# EAGLE design a52-flashcart (EAGLE 7.0.0)
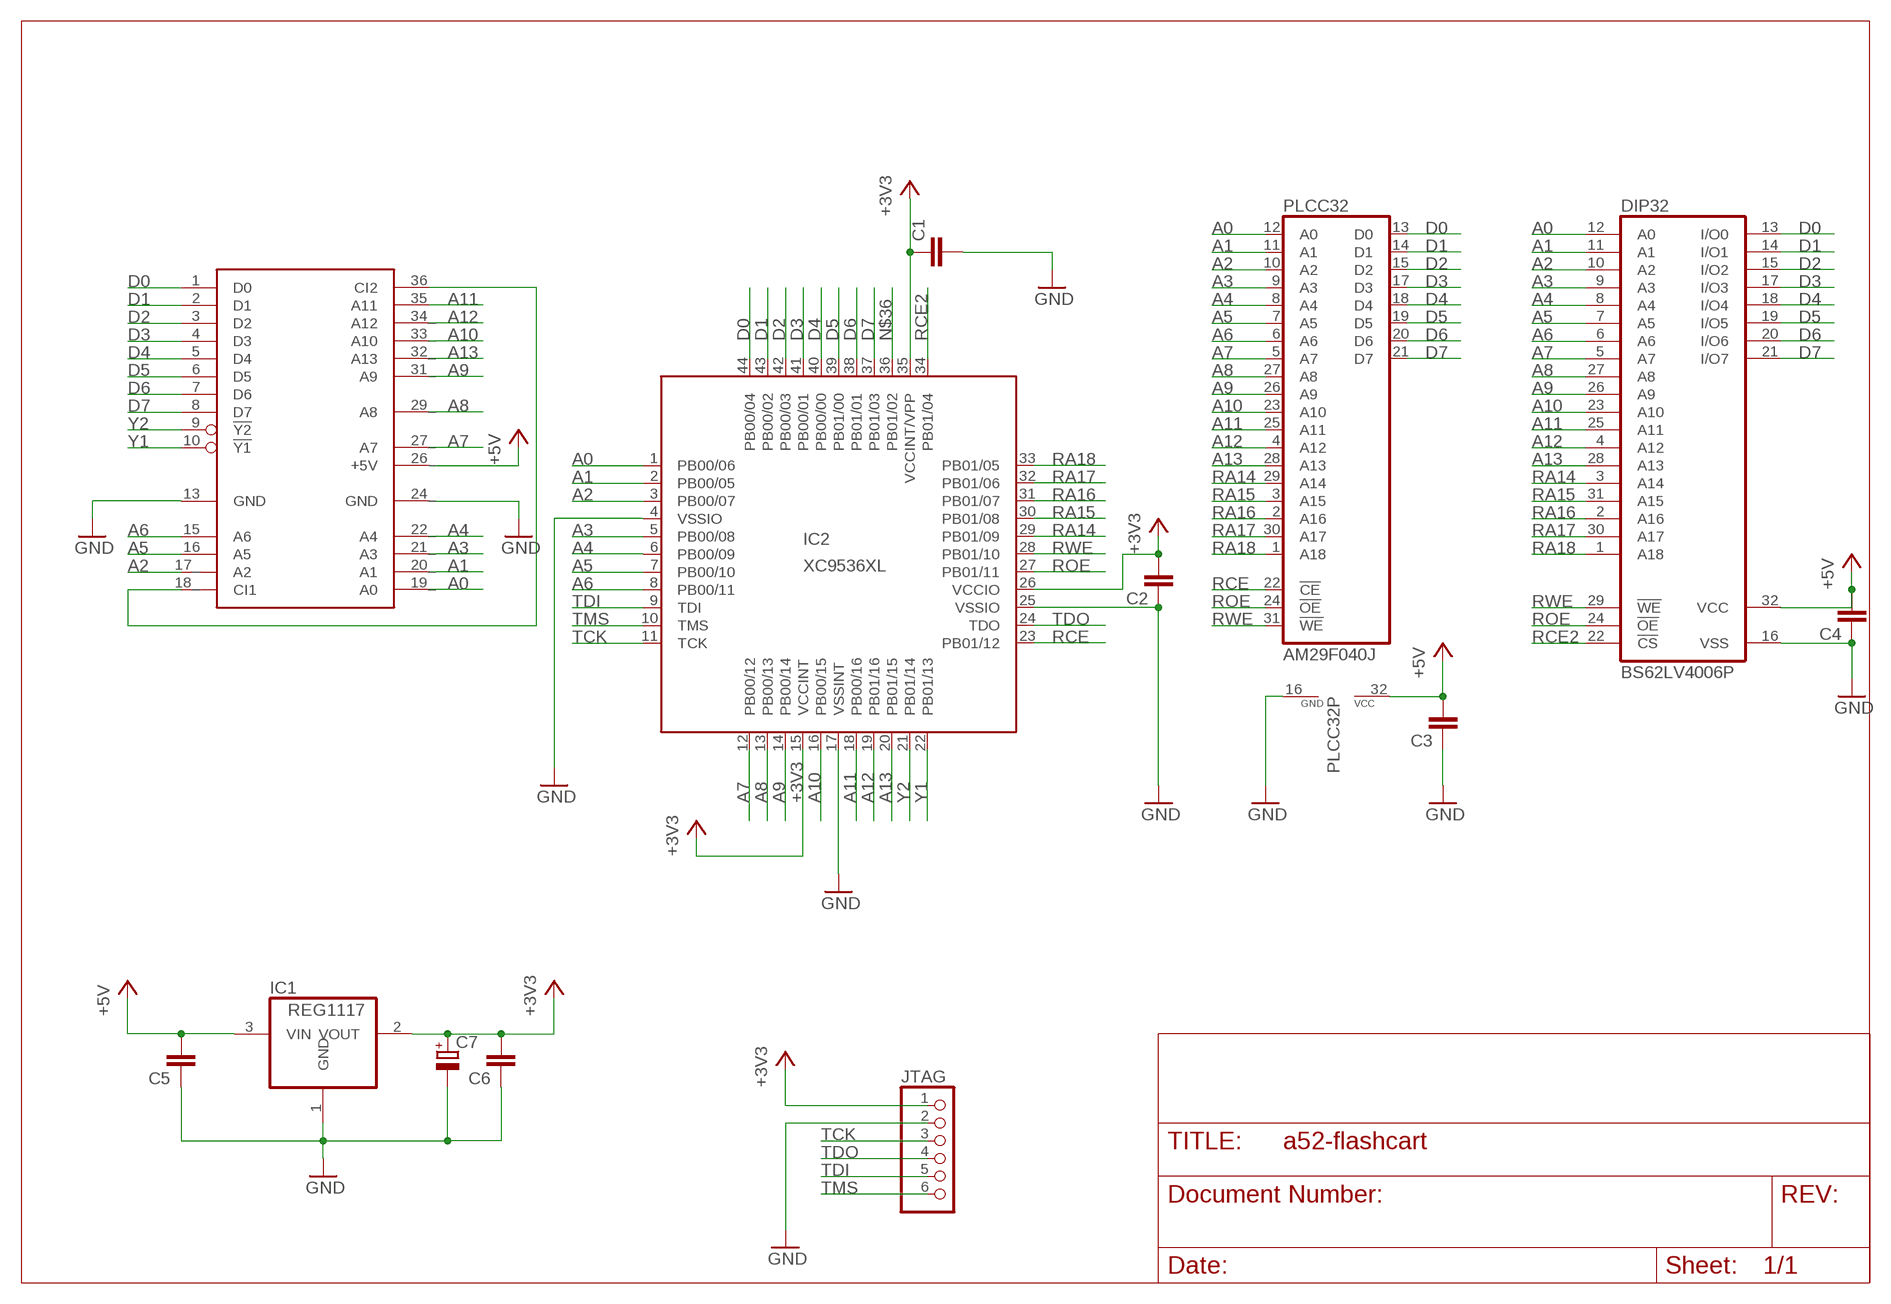
[diagram p0: schematic, sheet 1]

## Parts
C1  C-EUC0603  [C0603]
C2  C-EUC0603  [C0603]
C3  C-EUC0603  [C0603]
C4  C-EUC0603  [C0603]
C5  C-EUC0603  [C0603]
C6  C-EUC0603  [C0603]
C7  CPOL-EUE2,5-6E  [E25-6E]
DIP32  BS62LV4006P  [DIL-32]
IC1  REG1117  [SOT223]
IC2  XC9536XL  XC9536_44VQ  [SQFP-S-10X10-44]
JTAG  PINHD-1X6  [1X06]
PLCC32  AM29F040J  [PLCC32R]
U$1  ATARI-5200  [ATARI-5200]

## Nets
+3V3: C1.1 C2.2 C6.2 C7.+ IC1.2(VOUT) IC2.15(VCCINT) IC2.26(VCCIO) IC2.35(VCCINT/VPP) JTAG.1
+5V: C3.2 C4.2 C5.2 DIP32.32(VCC) IC1.3(VIN) PLCC32.32(VCC) U$1.26_(+5V)
A0: DIP32.12(A0) IC2.1(PB00/06) PLCC32.12(A0) U$1.19_(A0)
A1: DIP32.11(A1) IC2.2(PB00/05) PLCC32.11(A1) U$1.20_(A1)
A2: DIP32.10(A2) IC2.3(PB00/07) PLCC32.10(A2) U$1.17_(A2)
A3: DIP32.9(A3) IC2.5(PB00/08) PLCC32.9(A3) U$1.21_(A3)
A4: DIP32.8(A4) IC2.6(PB00/09) PLCC32.8(A4) U$1.22_(A4)
A5: DIP32.7(A5) IC2.7(PB00/10) PLCC32.7(A5) U$1.16(A5)
A6: DIP32.6(A6) IC2.8(PB00/11) PLCC32.6(A6) U$1.15(A6)
A7: DIP32.5(A7) IC2.12(PB00/12) PLCC32.5(A7) U$1.27_(A7)
A8: DIP32.27(A8) IC2.13(PB00/13) PLCC32.27(A8) U$1.29_(A8)
A9: DIP32.26(A9) IC2.14(PB00/14) PLCC32.26(A9) U$1.31_(A9)
A10: DIP32.23(A10) IC2.16(PB00/15) PLCC32.23(A10) U$1.33_(A10)
A11: DIP32.25(A11) IC2.18(PB00/16) PLCC32.25(A11) U$1.35(A11)
A12: DIP32.4(A12) IC2.19(PB01/16) PLCC32.4(A12) U$1.34_(A12)
A13: DIP32.28(A13) IC2.20(PB01/15) PLCC32.28(A13) U$1.32_(A13)
D0: DIP32.13(I/O0) IC2.44(PB00/04) PLCC32.13(D0) U$1.1(D0)
D1: DIP32.14(I/O1) IC2.43(PB00/02) PLCC32.14(D1) U$1.2(D1)
D2: DIP32.15(I/O2) IC2.42(PB00/03) PLCC32.15(D2) U$1.3(D2)
D3: DIP32.17(I/O3) IC2.41(PB00/01) PLCC32.17(D3) U$1.4(D3)
D4: DIP32.18(I/O4) IC2.40(PB00/00) PLCC32.18(D4) U$1.5(D4)
D5: DIP32.19(I/O5) IC2.39(PB01/00) PLCC32.19(D5) U$1.6(D5)
D6: DIP32.20(I/O6) IC2.38(PB01/01) PLCC32.20(D6) U$1.7(D6)
D7: DIP32.21(I/O7) IC2.37(PB01/03) PLCC32.21(D7) U$1.8(D7)
GND: C1.2 C2.1 C3.1 C4.1 C5.1 C6.1 C7.- DIP32.16(VSS) IC1.1(GND) IC2.4(VSSIO) IC2.17(VSSINT) IC2.25(VSSIO) JTAG.2 PLCC32.16(GND) U$1.13(GND) U$1.24_(GND)
N$14: U$1.18_(CI1) U$1.36(CI2)
N$36: IC2.36(PB01/02)
RA14: DIP32.3(A14) IC2.29(PB01/09) PLCC32.29(A14)
RA15: DIP32.31(A15) IC2.30(PB01/08) PLCC32.3(A15)
RA16: DIP32.2(A16) IC2.31(PB01/07) PLCC32.2(A16)
RA17: DIP32.30(A17) IC2.32(PB01/06) PLCC32.30(A17)
RA18: DIP32.1(A18) IC2.33(PB01/05) PLCC32.1(A18)
RCE: IC2.23(PB01/12) PLCC32.22(!CE)
RCE2: DIP32.22(!CS) IC2.34(PB01/04)
ROE: DIP32.24(!OE) IC2.27(PB01/11) PLCC32.24(!OE)
RWE: DIP32.29(!WE) IC2.28(PB01/10) PLCC32.31(!WE)
TCK: IC2.11(TCK) JTAG.3
TDI: IC2.9(TDI) JTAG.5
TDO: IC2.24(TDO) JTAG.4
TMS: IC2.10(TMS) JTAG.6
Y1: IC2.22(PB01/13) U$1.10(!Y1)
Y2: IC2.21(PB01/14) U$1.9(!Y2)

## Library data of the parts
C1-C6 = resistor:C-EU: CAPACITOR, European symbol
C7 = resistor:CPOL-EU: POLARIZED CAPACITOR, European symbol
DIP32 = memory-bsi:BS62LV4006
IC1 = burr-brown:REG1117: 800mA and 1A Low Dropout (LDO) Positive Regulator 1.8V, 2.5V, 2.85V, 3.3V, 5V, and Adj; MPN: REG1117; OC_FARNELL: 1097566; OC_NEWARK: 14P6981
IC2 = xilinx-xc9:XC9536_44VQ: xc9536_pc44 XC9500 In-System Programmable CPLD Family Auto generated by make-symbol-device-package-bsdl.ulp Rev. 34 Source: xc9536_vq44.bsd; MPN: XC9536-15VQG44C; OC_FARNELL: 1193227; OC_NEWARK: 98K3377
JTAG = adafruit:PINHD-1X6: PIN HEADER
PLCC32 = am29-memory:AM29F040J: 4-Megabit FLASH MEMORY (512 K x 8 bit) 5 V-only
U$1 = a52-cartridge:ATARI-5200

## Board
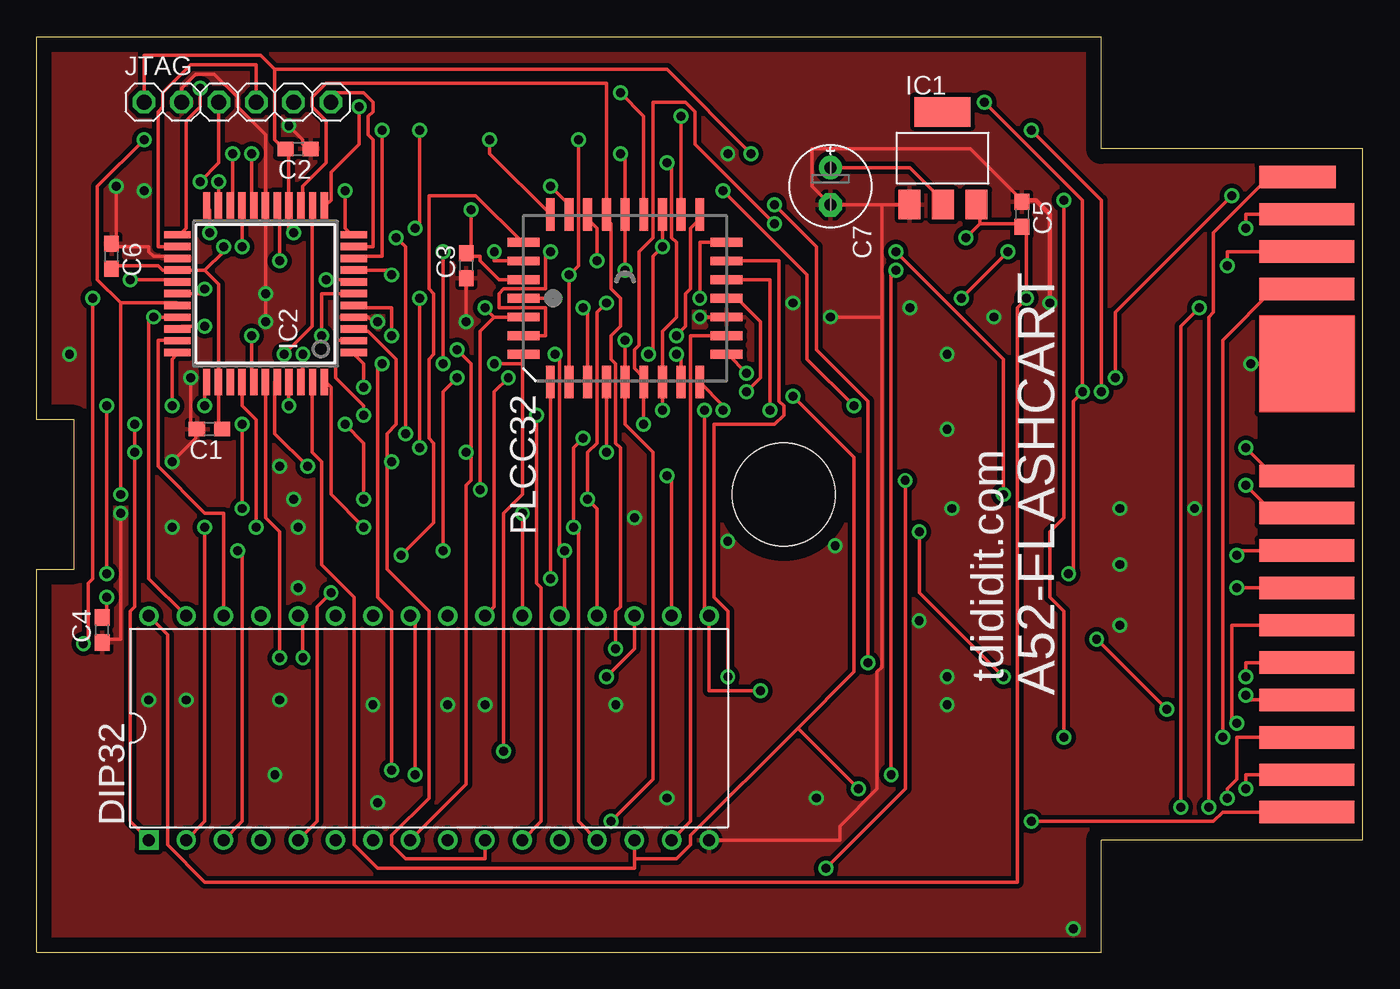
[diagram p1: board, top side]
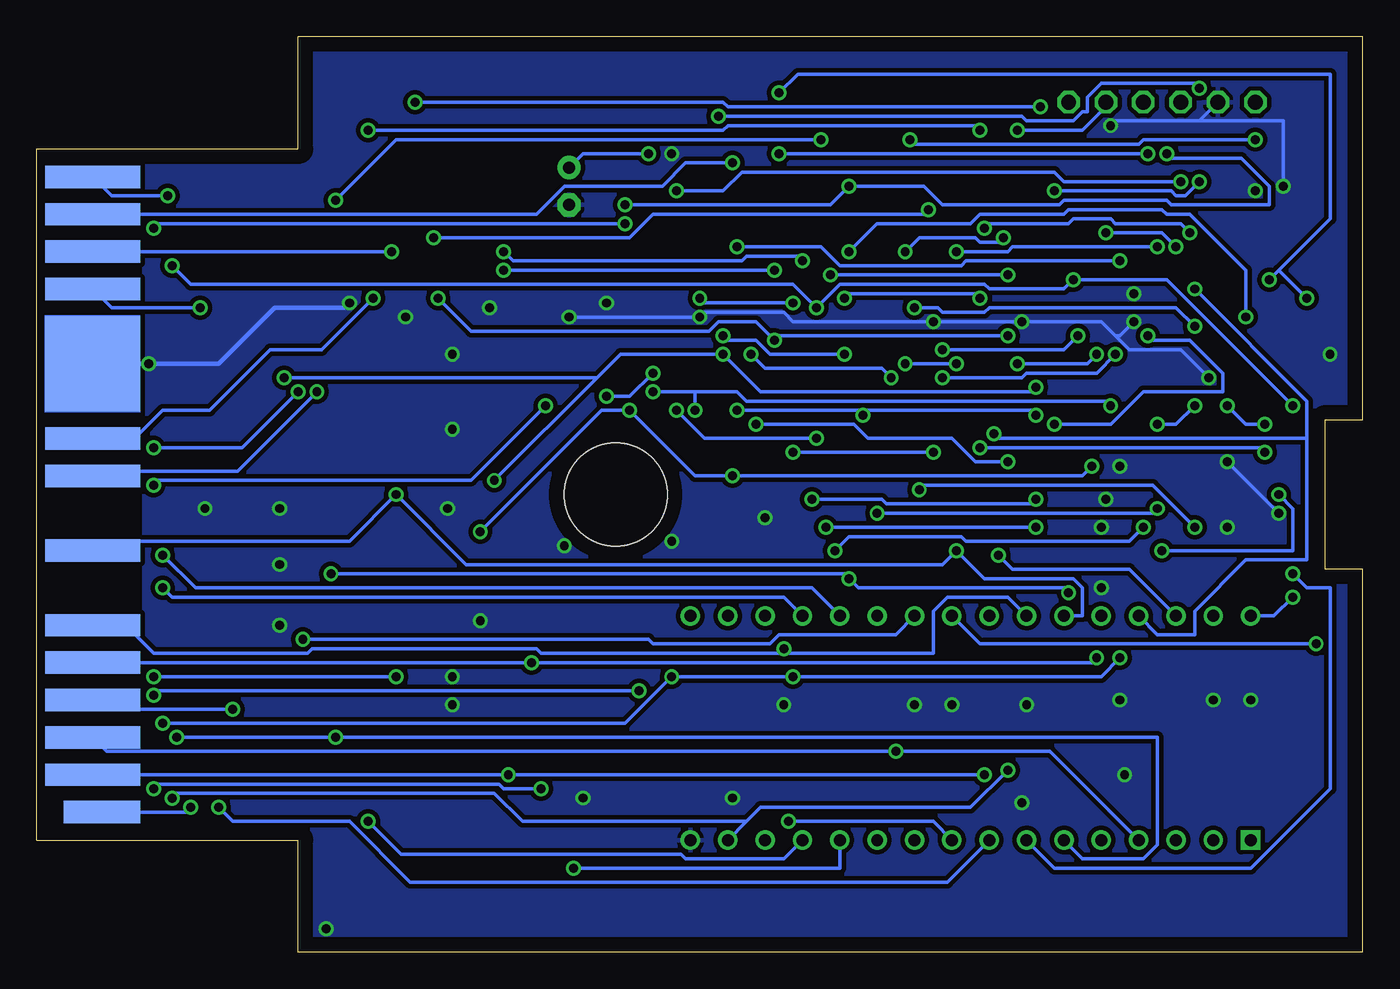
[diagram p2: board, bottom side, seen from below]

Size 90.17 x 62.23 mm. Coordinates in mm from the lower left corner, seen from the top.
Copper layers (1*16): Top 0.035mm / dielectric 1.5mm / Bottom 0.035mm
Design rules "default": minimum track width 10mil, minimum drill 24mil, track to track 8mil, track to pad 8mil, pad to pad 8mil, via to via 8mil, smd to smd 8mil, copper to edge 40mil, drill to drill 8mil, minimum pad ring 10mil, minimum via ring 8mil, stop-mask expansion 4mil, vias tented up to drill 0mil, thermal gap 10mil

### Footprints (pad centres in the part's own frame; a part is rotated, then mirrored left to right if it is on the bottom)
C0603 = smd 1.1 x 1: 1 -0.85,0; 2 0.85,0
E25-6E = drill 0.813 pad 1.575: + -1.27,0 | drill 0.813 pad 1.575 octagon: - 1.27,0
DIL-32 = drill 0.813 square: 1 -19.05,-7.62 | drill 0.813: 2 -16.51,-7.62; 3 -13.97,-7.62; 4 -11.43,-7.62; 5 -8.89,-7.62; 6 -6.35,-7.62; 7 -3.81,-7.62; 8 -1.27,-7.62; 9 1.27,-7.62; 10 3.81,-7.62; 11 6.35,-7.62; 12 8.89,-7.62; 13 11.43,-7.62; 14 13.97,-7.62; 15 16.51,-7.62; 16 19.05,-7.62; 17 19.05,7.62; 18 16.51,7.62; 19 13.97,7.62; 20 11.43,7.62; 21 8.89,7.62; 22 6.35,7.62; 23 3.81,7.62; 24 1.27,7.62; 25 -1.27,7.62; 26 -3.81,7.62; 27 -6.35,7.62; 28 -8.89,7.62; 29 -11.43,7.62; 30 -13.97,7.62; 31 -16.51,7.62; 32 -19.05,7.62
SOT223 = smd 1.499 x 2.007: 1 -2.261,-3.15; 2 0.025,-3.15; 3 2.311,-3.15 | smd 3.81 x 2.007: 4 0,3.15
SQFP-S-10X10-44 = smd 0.5 x 1.8: 1 -4,-6; 2 -3.2,-6; 3 -2.4,-6; 4 -1.6,-6; 5 -0.8,-6; 6 0,-6; 7 0.8,-6; 8 1.6,-6; 9 2.4,-6; 10 3.2,-6; 11 4,-6; 23 4,6; 24 3.2,6; 25 2.4,6; 26 1.6,6; 27 0.8,6; 28 0,6; 29 -0.8,6; 30 -1.6,6; 31 -2.4,6; 32 -3.2,6; 33 -4,6 | smd 1.8 x 0.5: 12 6,-4; 13 6,-3.2; 14 6,-2.4; 15 6,-1.6; 16 6,-0.8; 17 6,0; 18 6,0.8; 19 6,1.6; 20 6,2.4; 21 6,3.2; 22 6,4; 34 -6,4; 35 -6,3.2; 36 -6,2.4; 37 -6,1.6; 38 -6,0.8; 39 -6,0; 40 -6,-0.8; 41 -6,-1.6; 42 -6,-2.4; 43 -6,-3.2; 44 -6,-4
1X06 = drill 1.016 octagon: 1 -6.35,0; 2 -3.81,0; 3 -1.27,0; 4 1.27,0; 5 3.81,0; 6 6.35,0
PLCC32R = smd 0.6 x 2.2: 1 0,6.9; 2 -1.27,6.9; 3 -2.54,6.9; 4 -3.81,6.9; 14 -3.81,-6.9; 15 -2.54,-6.9; 16 -1.27,-6.9; 17 0,-6.9; 18 1.27,-6.9; 19 2.54,-6.9; 20 3.81,-6.9; 30 3.81,6.9; 31 2.54,6.9; 32 1.27,6.9 | smd 2.2 x 0.6: 5 -5.7,5.08; 6 -5.7,3.81; 7 -5.7,2.54; 8 -5.7,1.27; 9 -5.7,0; 10 -5.7,-1.27; 11 -5.7,-2.54; 12 -5.7,-3.81; 13 -5.7,-5.08; 21 5.7,-5.08; 22 5.7,-3.81; 23 5.7,-2.54; 24 5.7,-1.27; 25 5.7,0; 26 5.7,1.27; 27 5.7,2.54; 28 5.7,3.81; 29 5.7,5.08
ATARI-5200 = smd 1.524 x 6.477: 1 -21.59,3.81; 2 -19.05,3.81; 3 -16.51,3.81; 4 -13.97,3.81; 5 -11.43,3.81; 6 -8.89,3.81; 7 -6.35,3.81; 8 -3.81,3.81; 9 -1.27,3.81; 10 1.27,3.81; 15 13.97,3.81; 16 16.51,3.81; 17_ 19.05,3.81 | smd 6.452 x 6.477: 13 8.89,3.81 | smd 1.524 x 5.207: 18_ 21.59,4.445 | smd 1.524 x 6.477 bottom: 19_ 21.59,3.81; 20_ 19.05,3.81; 21_ 16.51,3.81; 22_ 13.97,3.81; 26_ 3.81,3.81; 27_ 1.27,3.81; 29_ -3.81,3.81; 31_ -8.89,3.81; 32_ -11.43,3.81; 33_ -13.97,3.81; 34_ -16.51,3.81; 35 -19.05,3.81 | smd 6.452 x 6.477 bottom: 24_ 8.89,3.81 | smd 1.524 x 5.207 bottom: 36 -21.59,4.445 | hole 7: 0,39.37

### Placement (x,y rotation side)
C1  11.75,35.56 180 top
C2  17.78,54.61 180 top
C3  29.21,46.67 90 top
C4  4.45,21.91 90 top
C5  66.99,50.16 270 top
C6  5.08,47.31 270 top
C7  53.98,52.07 270 top
DIP32  26.67,15.24 0 top
IC1  61.59,53.97 0 top
IC2  15.56,44.77 90 top
JTAG  13.65,57.78 0 top
PLCC32  40.01,44.45 90 top
U$1  90.17,31.11 90 top

### Tracks (layer width: path | path; a pad name or v marks a point on that pad's centre or on a via)
+3V3  (via drill 0.61)
  Top 0.254: C1.1 12.38,35.56 12.38,38.73 IC2.35 12.38,39.05 12.38,45.4 11.43,46.36 | C6.2 5.08,46.67 8.26,46.67 8.57,46.36 9.53,46.36 IC2.26 9.84,46.36 11.43,46.36 | C7.+ 59.37,53.34 61.59,51.12 IC1.2 | 16.19,60.01 16.19,55.24 16.83,54.61 C2.2 17.15,54.61 17.15,50.8 IC2.15 17.15,50.48 17.15,49.21 v17.46,48.89 | 16.19,60.01 15.24,60.96 7.3,60.96 JTAG.1 | v48.58,54.29 42.86,60.01 16.19,60.01 | 11.43,46.36 12.7,47.62 v12.7,47.94
  Bottom 0.254: C7.+ 53.02,54.29 v48.58,54.29 | v12.7,47.94 13.65,48.89 v17.46,48.89
+5V  (via drill 0.61)
  Top 0.254: PLCC32.32 31.43,45.72 30.16,46.99 30.16,47.31 29.21,47.31 C3.2 29.21,47.62 29.53,47.94 v29.53,50.48 | v4.76,24.13 4.76,23.18 4.45,22.86 C4.2 | 64.14,49.53 66.99,49.53 C5.2 66.99,49.21 67.31,48.89 v67.31,44.45 66.68,43.81 66.68,4.76 11.43,4.76 8.89,7.3 8.89,21.59 DIP32.32 | 64.14,49.53 64.14,50.8 IC1.3 | 64.14,49.53 v63.18,48.58
  Bottom 0.254: 86.23,35.05 U$1.26_ 83.5,34.92 81.6,36.83 78.42,36.83 74.3,40.96 70.8,40.96 v67.31,44.45 | v4.76,24.13 6.03,22.86 DIP32.32 | v29.53,50.48 29.85,50.16 48.26,50.16 49.85,48.58 v63.18,48.58
A0  (via drill 0.61)
  Top 0.254: v22.23,38.42 22.23,40 21.59,40.64 IC2.1 | v43.5,40.64 43.82,40.32 PLCC32.12 | v53.66,5.71 59.06,11.11 v59.06,32.07 | v81.28,51.44 73.34,43.5 v73.34,39.05
  Bottom 0.254: 86.23,52.65 U$1.19_ 85.09,51.44 v81.28,51.44 | v22.23,38.42 22.54,38.1 40.96,38.1 v43.5,40.64 50.48,40.64 52.07,39.05 | DIP32.12 35.56,5.71 v53.66,5.71 | 52.07,39.05 v59.06,32.07 | 52.07,39.05 v73.34,39.05
A1  (via drill 0.61)
  Top 0.254: v22.23,36.51 22.23,37.15 20.32,39.05 20.32,41.59 21.27,41.59 IC2.2 | v42.55,36.83 PLCC32.11 42.55,42.23 43.5,43.18 43.5,48.26 43.18,48.58 43.18,53.34 v42.86,53.66 | DIP32.11 34.29,8.89 34.29,24.76 33.97,25.08 v33.97,36.51
  Bottom 0.254: 86.23,50.37 U$1.20_ 56.2,50.16 54.29,52.07 47.63,52.07 46.04,53.66 v42.86,53.66 | v22.23,36.51 22.54,36.83 33.97,36.83 | v42.55,36.83 33.97,36.83 | 33.97,36.83 v33.97,36.51
A2  (via drill 0.61)
  Top 0.254: 86.23,50.37 U$1.17_ 82.23,50.16 v82.23,49.21 | 23.81,33.34 23.81,26.04 26.67,23.18 26.67,10.48 24.13,7.94 24.13,7.3 25.08,6.35 30.48,6.35 DIP32.10 | 23.81,33.34 23.81,35.24 24.45,35.88 24.45,40.32 22.54,42.23 21.59,42.23 IC2.3 | v41.28,35.88 PLCC32.10 41.28,39.05 40.64,39.69 40.64,40.96 40.96,41.27 40.96,47.62 41.91,48.58 41.91,57.78 44.13,57.78 44.77,57.15 44.77,54.93 v50.17,49.53 | 23.81,33.34 v24.13,33.34
  Bottom 0.254: v41.28,35.88 34.61,35.88 33.66,34.92 27.94,34.92 26.35,33.34 v24.13,33.34 | v82.23,49.21 81.92,49.53 v50.17,49.53
A3  (via drill 0.61)
  Top 0.254: v24.13,41.91 24.13,43.81 21.59,43.81 IC2.5 | v40.01,41.59 PLCC32.9 40.01,35.88 41.91,33.97 41.91,11.75 v39.05,8.89 | v62.87,44.45 v66.04,47.62
  Bottom 0.254: v24.13,41.91 39.69,41.91 v40.01,41.59 41.28,42.86 43.82,42.86 44.45,42.23 60.64,42.23 v62.87,44.45 | DIP32.9 29.21,8.89 v39.05,8.89 | v66.04,47.62 U$1.21_
A4  (via drill 0.61)
  Top 0.254: IC2.6 19.37,44.77 v19.37,41.91 | v28.58,40.96 29.53,40 29.53,33.97 | 29.53,33.97 29.53,32.07 29.21,31.75 29.21,11.43 DIP32.8 | v38.74,33.97 PLCC32.8 | 29.53,33.97 v29.21,33.97 | v79.06,43.81 77.79,42.55 v77.79,9.84
  Bottom 0.254: 86.23,44.88 U$1.22_ 85.09,43.81 v79.06,43.81 | v19.37,41.91 20.32,40.96 v28.58,40.96 | v29.21,33.97 v38.74,33.97 | v77.79,9.84 76.84,8.89 68.9,8.89 64.77,4.76 28.26,4.76 DIP32.8
A5  (via drill 0.61)
  Top 0.254: v19.69,45.72 21.27,45.72 IC2.7 | v37.15,43.81 37.47,43.5 PLCC32.7 | v4.76,37.15 v4.76,25.72 | U$1.16 80.96,47.62 v80.96,46.67
  Bottom 0.254: DIP32.7 20.96,5.71 7.62,5.71 2.22,11.11 2.22,24.76 3.81,24.76 v4.76,25.72 | v4.76,37.15 13.34,45.72 v19.69,45.72 20.32,45.08 25.4,45.08 25.72,45.4 35.56,45.4 v37.15,43.81 38.74,45.4 79.69,45.4 v80.96,46.67
A6  (via drill 0.61)
  Top 0.254: 86.23,45.11 U$1.15 84.14,45.08 80.65,41.59 v80.65,14.6 | v24.13,46.04 24.13,46.36 21.59,46.36 IC2.8 | PLCC32.6 v36.2,46.04 36.83,46.67 v36.83,55.24 | v69.85,14.6 69.85,23.18 68.9,24.13 68.9,28.57 69.85,29.53 v69.85,51.12
  Bottom 0.254: v36.2,46.04 v24.13,46.04 | DIP32.6 19.05,6.35 14.92,6.35 13.97,7.3 13.97,14.6 v69.85,14.6 v80.65,14.6 | v36.83,55.24 65.72,55.24 v69.85,51.12
A7  (via drill 0.61)
  Top 0.254: v34.93,25.4 PLCC32.5 | v20,24.45 19.05,23.5 19.05,8.89 DIP32.5 | v21.91,57.47 21.91,54.93 20,53.02 20,51.12 19.69,50.8 IC2.12 | v64.45,57.78 71.12,51.12 v71.12,38.1 70.48,37.47 70.48,26.04 v70.17,25.72
  Bottom 0.254: 86.23,32.31 U$1.27_ 86.04,32.7 76.52,32.7 v71.12,38.1 | v20,24.45 20.32,24.76 34.29,24.76 v34.93,25.4 35.24,25.72 v70.17,25.72 | v21.91,57.47 43.18,57.47 43.5,57.78 v64.45,57.78
A8  (via drill 0.61)
  Top 0.254: v16.83,40.64 18.73,42.55 18.73,50.48 IC2.13 | v28.58,39.05 27.62,38.1 v27.62,27.3 | v38.1,46.99 38.1,49.21 37.47,49.85 PLCC32.27 | v58.42,47.62 65.72,40.32 v65.72,31.11
  Bottom 0.254: 86.23,27.28 U$1.29_ 85.73,27.94 68.9,27.94 v65.72,31.11 60.96,26.35 28.58,26.35 v27.62,27.3 25.72,25.4 19.69,25.4 19.05,24.76 19.05,22.86 DIP32.27 | v16.83,40.64 18.1,39.37 22.86,39.37 23.18,39.05 v28.58,39.05 | v38.1,46.99 38.42,47.31 41.91,47.31 42.23,46.99 57.79,46.99 v58.42,47.62
A9  (via drill 0.61)
  Top 0.254: IC2.14 18.1,50.8 18.1,52.07 19.69,53.66 19.69,56.52 18.73,57.47 18.73,58.1 19.69,59.05 38.74,59.05 PLCC32.26 38.74,49.85 39.05,49.53 39.05,45.08 39.69,44.45 39.69,42.55 39.05,41.91 39.05,40.32 39.37,40 39.37,34.61 39.69,34.29 39.69,23.5 39.37,23.18 v39.37,20.64
  Bottom 0.254: 86.23,22.25 U$1.31_ 84.14,22.22 82.23,20.32 71.76,20.32 71.44,20.64 56.2,20.64 55.88,20.32 39.37,20.32 | DIP32.26 24.13,24.13 28.26,24.13 29.21,23.18 29.21,20.32 39.37,20.32 | 39.37,20.32 v39.37,20.64
A10  (via drill 0.61)
  Top 0.254: v16.51,46.99 16.51,50.48 IC2.16 | PLCC32.23 v42.55,47.94 41.91,47.31 41.91,40.96 v41.59,40.64 | DIP32.23 31.12,23.5 31.12,38.1 v32.07,39.05 | v72.07,21.27 v76.84,16.51
  Bottom 0.254: 86.23,17.22 U$1.33_ 85.73,16.51 v76.84,16.51 | v16.51,46.99 26.99,46.99 27.31,46.67 35.56,46.67 36.83,47.94 v42.55,47.94 | v32.07,39.05 32.7,39.69 40.64,39.69 v41.59,40.64 | v72.07,21.27 48.58,21.27 48.26,20.95 40.32,20.95 39.69,21.59 31.75,21.59 DIP32.23
A11  (via drill 0.61)
  Top 0.254: v14.61,54.29 14.61,50.8 IC2.18 | v39.69,54.29 40.01,53.97 PLCC32.25 v40.01,46.36 | DIP32.25 25.72,22.54 v25.72,12.06 | v58.42,46.36 58.1,46.04 v58.1,12.06
  Bottom 0.254: 86.23,11.96 U$1.35 v58.1,12.06 v25.72,12.06 | v39.69,54.29 v14.61,54.29 | v58.42,46.36 v40.01,46.36
A12  (via drill 0.61)
  Top 0.254: v13.97,47.94 13.97,50.48 IC2.19 | v27.62,40 v27.62,47.62 | 33.02,40 v31.12,40 | 33.02,40 33.02,40.64 PLCC32.4 | 33.02,40 33.02,31.11 31.75,29.84 v31.75,13.65
  Bottom 0.254: 86.23,14.48 U$1.34_ 85.41,13.65 v31.75,13.65 21.27,13.65 DIP32.4 | v13.97,47.94 23.81,47.94 24.13,47.62 v27.62,47.62 | v31.12,40 v27.62,40
A13  (via drill 0.61)
  Top 0.254: v13.34,54.29 13.34,50.8 IC2.20 | v34.93,52.07 36.2,50.8 PLCC32.28 | DIP32.28 18.1,22.54 v18.1,20 | v50.17,50.8 53.02,47.94 53.02,40.96 56.52,37.47 v56.52,19.68
  Bottom 0.254: 86.23,19.51 U$1.32_ v56.52,19.68 18.42,19.68 v18.1,20 | v13.34,54.29 13.02,53.97 8.26,53.97 6.35,52.07 6.35,50.8 13.02,50.8 13.34,51.12 20.32,51.12 20.64,50.8 28.58,50.8 29.85,52.07 v34.93,52.07 36.2,50.8 v50.17,50.8
D0  (via drill 0.61)
  Top 0.254: 86.23,9.45 U$1.1 80.65,9.52 80.01,8.89 v67.63,8.89 | v22.23,28.89 20,31.11 20,38.42 19.69,38.73 IC2.44 | DIP32.13 36.83,8.89 36.83,28.57 v36.51,28.89 36.51,34.29 v37.15,34.92 | v46.67,36.83 46.67,37.15 PLCC32.13
  Bottom 0.254: v36.51,28.89 v22.23,28.89 | v46.67,36.83 44.77,34.92 v37.15,34.92 | v67.63,8.89 65.41,6.67 46.36,6.67 46.04,6.35 39.37,6.35 DIP32.13
D1  (via drill 0.61)
  Top 0.254: 86.23,12.19 U$1.2 82.23,12.06 v82.23,11.11 | DIP32.14 40.64,6.35 | 40.64,6.35 40.64,5.71 23.18,5.71 21.59,7.3 21.59,24.13 19.37,26.35 19.37,33.34 18.73,33.97 18.73,38.73 IC2.43 | v48.26,39.37 46.99,40.64 PLCC32.14 | v51.44,37.78 55.56,33.66 55.56,19.05 51.75,15.24 | 51.75,15.24 44.45,7.94 44.45,7.3 43.5,6.35 40.64,6.35 | 51.75,15.24 v55.88,11.11
  Bottom 0.254: v48.26,39.37 49.85,37.78 v51.44,37.78 | v82.23,11.11 81.92,11.43 58.74,11.43 58.42,11.11 v55.88,11.11
D2  (via drill 0.61)
  Top 0.254: 86.23,14.48 U$1.3 81.6,14.6 81.6,11.75 80.96,11.11 v80.96,10.48 | v18.1,40.64 18.1,39.05 IC2.42 | v23.5,40 23.18,39.69 23.18,24.13 24.13,23.18 v24.13,12.38 | PLCC32.15 44.45,41.91 44.45,8.89 DIP32.15
  Bottom 0.254: v18.1,40.64 18.73,40 v23.5,40 | v24.13,12.38 26.67,9.84 40.96,9.84 41.91,8.89 | DIP32.15 41.91,8.89 | v80.96,10.48 80.65,10.79 59.06,10.79 57.15,8.89 41.91,8.89
D3  (via drill 0.61)
  Top 0.254: 86.23,17.22 U$1.4 82.23,17.14 v82.23,17.46 | v17.15,37.15 17.15,38.73 IC2.41 | v48.26,38.1 49.21,39.05 49.21,42.86 47.63,44.45 PLCC32.17 | v45.4,36.83 45.4,23.18 DIP32.17 45.72,17.78 v49.21,17.78
  Bottom 0.254: v17.15,37.15 17.46,37.47 41.91,37.47 42.55,38.1 45.4,38.1 | v48.26,38.1 45.4,38.1 | 45.4,38.1 v45.4,36.83 | v82.23,17.46 81.92,17.78 v49.21,17.78
D4  (via drill 0.61)
  Top 0.254: 86.23,19.74 U$1.5 82.23,19.68 v82.23,18.73 | v18.42,33.02 16.19,35.24 16.19,38.73 IC2.40 | v42.86,32.38 43.18,32.07 DIP32.18 | PLCC32.18 49.85,45.72 v49.85,36.83 | v65.72,18.73 60.01,24.45 v60.01,28.57
  Bottom 0.254: v18.42,33.02 19.05,32.38 v42.86,32.38 45.4,32.38 v49.85,36.83 51.75,36.83 v60.01,28.57 | v65.72,18.73 v82.23,18.73
D5  (via drill 0.61)
  Top 0.254: 86.23,22.25 U$1.6 81.28,22.22 81.28,15.87 v81.6,15.56 | IC2.39 15.56,29.53 16.51,28.57 v16.51,20 | v38.74,18.73 40.64,20.64 DIP32.19 | PLCC32.19 50.48,46.99 50.48,37.47 50.8,37.15 50.8,36.51 50.17,35.88 46.04,35.88 46.04,24.13 46.99,23.18 v46.99,18.73
  Bottom 0.254: v16.51,20 17.78,18.73 v38.74,18.73 v46.99,18.73 50.17,15.56 v81.6,15.56
D6  (via drill 0.61)
  Top 0.254: v14.61,41.91 14.61,39.05 IC2.38 | v20.96,35.88 22.23,34.61 v22.23,30.8 | DIP32.20 38.1,30.16 v37.47,30.8 37.47,33.97 38.1,34.61 38.1,43.5 v38.74,44.13 | PLCC32.20 45.09,48.26 v45.09,44.45 | v81.6,24.76 U$1.7
  Bottom 0.254: v14.61,41.91 14.29,41.59 11.75,41.59 9.53,39.37 9.53,38.1 14.92,38.1 17.15,35.88 v20.96,35.88 | v22.23,30.8 22.54,30.48 32.39,30.48 32.7,30.8 v37.47,30.8 | v45.09,44.45 44.77,44.13 v38.74,44.13 | v81.6,24.76 80.96,24.13 39.37,24.13 DIP32.20
D7  (via drill 0.61)
  Top 0.254: 86.23,27.51 U$1.8 81.6,27.3 v81.6,26.99 | v14.92,28.89 14.92,36.19 13.97,37.15 13.97,38.73 IC2.37 | DIP32.21 35.88,23.18 v35.88,27.3 35.56,27.62 35.56,40.32 v35.24,40.64 | v43.5,41.91 44.13,42.55 44.13,44.77 44.45,45.08 44.45,49.21 45.09,49.85 PLCC32.21
  Bottom 0.254: v14.92,28.89 15.88,27.94 26.99,27.94 27.31,28.26 34.93,28.26 v35.88,27.3 | v43.5,41.91 43.18,41.59 41.28,41.59 40.32,40.64 v35.24,40.64 | v81.6,26.99 79.38,24.76 37.47,24.76 DIP32.21
GND  (via drill 0.6, 0.61)
  Top 0.254: C5.1 66.99,51.12 63.5,54.61 52.71,54.61 52.71,52.07 C7.- 57.47,50.8 | 57.47,50.8 59.06,50.8 IC1.1 | DIP32.16 54.61,7.62 54.61,8.57 57.15,11.11 57.15,19.05 57.47,19.37 57.47,43.18 | 57.47,50.8 57.47,43.18 | IC2.25 9.53,47.31 7.94,47.31 7.62,47.62 7.62,47.94 5.08,47.94 C6.1 5.08,48.26 5.4,48.58 v5.4,52.07 | v17.15,56.2 18.1,55.24 18.1,54.93 18.42,54.61 C2.1 | JTAG.2 9.84,58.74 10.8,59.69 12.07,59.69 13.65,58.1 13.65,57.47 15.56,55.56 IC2.17 v15.56,42.86 | v5.72,29.84 5.72,21.27 4.45,21.27 C4.1 | v9.21,33.34 10.8,34.92 10.8,35.56 | v29.21,42.86 C3.1 | v23.18,42.86 22.86,42.86 22.54,43.18 21.59,43.18 IC2.4 | v45.09,43.18 PLCC32.16 | 10.8,35.56 10.48,35.88 v10.48,39.05 | 10.8,35.56 C1.2 | v53.98,43.18 57.47,43.18
  Top 0.305: U$1.24_ v82.55,40 | v68.9,44.13 68.9,50.16 67.95,51.12 67.09,51.12 C5.1
  Bottom 0.254: v17.15,56.2 16.83,56.52 11.11,56.52 | JTAG.2 11.11,56.52 | v5.4,52.07 5.4,56.52 11.11,56.52 | v9.21,33.34 v5.72,29.84 | v10.48,39.05 12.38,40.96 15.88,40.96 16.83,41.91 | 16.83,41.91 17.78,42.86 v23.18,42.86 v29.21,42.86 38.74,42.86 39.37,43.5 44.77,43.5 v45.09,43.18 v53.98,43.18 | v15.56,42.86 16.51,41.91 16.83,41.91
  Bottom 0.305: v68.9,44.13 69.22,43.81 73.98,43.81 77.79,40 v82.55,40 U$1.24_
  other vias: 2.22,40.64 59.37,43.81 61.91,40.64 61.91,35.56 62.23,30.16 54.29,27.62 73.66,26.35 73.66,30.16 73.66,22.22 60.01,22.54 61.91,18.73 61.91,16.83 53.02,10.48 70.48,1.59 23.18,10.16 22.86,16.83 16.51,17.14 10.16,17.14 7.62,17.14 42.86,10.48 9.21,28.89 15.56,44.77 7.3,51.75 65.09,43.18 27.94,16.83 30.48,16.83 39.37,16.83 16.19,12.06 46.99,27.94 40.64,29.53 16.51,33.02 17.46,30.8 17.78,28.89 17.78,24.76 78.74,30.16 46.99,54.29 51.44,44.13
  pour Bottom (isolate 0.305): 0,62.23 0,0 82.87,0 82.87,62.23 0.32,62.23
  pour Top (isolate 0.305): 0,62.23 0,0 82.87,0 82.87,62.23 0.32,62.23
N$14  (via drill 0.61)
  Top 0.254: v79.69,9.84 79.69,43.18 80.01,43.5 80.01,48.89 83.82,52.7 U$1.18_
  Bottom 0.254: U$1.36 80.01,9.52 v79.69,9.84
RA14  (via drill 0.61)
  Top 0.254: 5.72,44.13 9.53,44.13 IC2.29 | v5.72,31.11 5.72,44.13 | v13.65,27.3 13.97,26.99 13.97,8.89 DIP32.3 | v30.8,55.24 30.8,54.29 PLCC32.29 | v7.3,55.24 4.13,52.07 4.13,45.72 5.72,44.13
  Bottom 0.254: v5.72,31.11 4.76,30.16 4.76,27.3 v13.65,27.3 | v30.8,55.24 30.48,54.93 15.24,54.93 14.92,55.24 v7.3,55.24
RA15  (via drill 0.61)
  Top 0.254: DIP32.31 7.62,25.4 7.62,43.18 v7.94,43.18 9.53,43.18 IC2.30 | PLCC32.3 34.61,41.91 34.61,43.81 31.43,43.81 31.43,44.77 31.75,45.08 34.61,45.08 34.61,47.31 v34.93,47.62
  Bottom 0.254: v34.93,47.62 33.02,49.53 26.67,49.53 26.04,50.16 20.32,50.16 20,50.48 13.65,50.48 13.34,50.16 11.75,50.16 7.94,46.36 v7.94,43.18
RA16  (via drill 0.61)
  Top 0.254: v11.43,42.55 9.84,42.55 IC2.31 | 31.12,43.18 v30.48,43.81 | PLCC32.2 31.12,43.18 | DIP32.2 11.43,8.89 v11.43,28.89 | v30.16,31.43 30.16,42.23 31.12,43.18
  Bottom 0.254: v11.43,42.55 12.7,43.81 25.4,43.81 25.72,43.5 28.58,43.5 28.89,43.81 v30.48,43.81 | v11.43,28.89 14.29,31.75 29.85,31.75 v30.16,31.43
RA17  (via drill 0.61)
  Top 0.254: DIP32.30 12.7,29.84 11.43,29.84 8.26,33.02 8.26,41.59 9.53,41.59 IC2.32 | v24.77,26.99 26.99,29.21 26.99,34.61 26.67,34.92 26.67,40.32 26.99,40.64 26.99,44.77 26.67,45.08 26.67,51.44 29.85,51.44 33.02,48.26 PLCC32.30
  Bottom 0.254: v24.77,26.99 23.81,26.04 15.88,26.04 DIP32.30
RA18  (via drill 0.61)
  Top 0.254: v9.21,37.15 9.21,40.32 9.53,40.64 IC2.33 | v6.67,35.88 v6.67,33.97 6.67,23.5 6.35,23.18 6.35,8.89 DIP32.1 | v35.24,44.45 PLCC32.1 | v26.04,34.29 v26.04,44.45
  Bottom 0.254: v9.21,37.15 7.94,35.88 v6.67,35.88 | v35.24,44.45 34.93,44.77 26.35,44.77 v26.04,44.45 | v26.04,34.29 6.99,34.29 v6.67,33.97
RCE  (via drill 0.61)
  Top 0.254: v11.11,58.74 11.11,57.47 10.16,56.52 10.16,49.21 9.84,48.89 IC2.23 | PLCC32.22 v43.82,56.83
  Bottom 0.254: v11.11,58.74 11.43,59.05 17.78,59.05 18.73,58.1 18.73,57.15 19.05,57.15 19.69,56.52 22.86,56.52 23.18,56.83 v43.82,56.83
RCE2  (via drill 0.61)
  Top 0.254: v11.43,37.15 11.43,38.73 IC2.34 | v13.97,30.16 v13.97,35.88 | DIP32.22 v33.02,29.84
  Bottom 0.254: v11.43,37.15 12.7,35.88 v13.97,35.88 | v13.97,30.16 14.29,29.84 v33.02,29.84
ROE  (via drill 0.61)
  Top 0.254: v6.35,45.72 9.53,45.72 IC2.27 | v39.69,58.42 41.28,56.83 PLCC32.24 | v3.18,20.95 3.49,21.27 3.49,25.08 3.81,25.4 v3.81,44.45
  Bottom 0.254: 5.72,46.36 2.22,49.85 2.22,59.69 38.42,59.69 v39.69,58.42 | 5.72,46.36 v6.35,45.72 | DIP32.24 26.04,20.95 v3.18,20.95 | 5.72,46.36 v3.81,44.45
RWE  (via drill 0.61)
  Top 0.254: IC2.28 11.43,44.77 v11.43,45.08 | PLCC32.31 31.12,46.99 v31.12,47.62 | v24.45,48.58 25.08,47.94 v25.08,35.24
  Bottom 0.254: v11.43,45.08 3.81,37.47 3.81,34.92 | 3.81,34.92 3.81,26.67 7.94,26.67 11.43,23.18 11.43,21.59 13.97,21.59 DIP32.29 | v31.12,47.62 30.16,48.58 26.35,48.58 26.04,48.26 24.77,48.26 v24.45,48.58 | v25.08,35.24 24.77,34.92 3.81,34.92
TCK  (via drill 0.61)
  Top 0.254: v20.96,51.75 20.96,49.21 21.27,48.89 IC2.11 | v11.11,52.39 12.38,53.66 JTAG.3
  Bottom 0.254: v20.96,51.75 13.02,51.75 12.7,51.44 12.07,51.44 v11.11,52.39
TDI  (via drill 0.61)
  Top 0.254: v23.5,55.88 23.5,47.31 21.59,47.31 IC2.9
  Bottom 0.254: v23.5,55.88 19.05,55.88 17.46,57.47 JTAG.5
TDO
  Top 0.254: JTAG.4 14.92,60.32 10.48,60.32 8.57,58.42 8.57,57.47 8.26,57.15 8.26,47.94 9.53,47.94 IC2.24
TMS
  Top 0.254: JTAG.6 20,58.42 22.23,58.42 22.86,57.78 22.86,57.15 22.54,56.83 22.54,55.56 22.86,55.24 22.86,47.94 21.59,47.94 IC2.10
Y1  (via drill 0.61)
  Top 0.254: 86.23,32.54 U$1.10 84.14,32.38 v82.23,34.29 | v11.75,48.89 11.75,50.48 IC2.22 | v25.72,49.21 26.04,49.53 v26.04,55.88 | v67.63,55.88 72.39,51.12 v72.39,38.1
  Bottom 0.254: v11.75,48.89 12.38,49.53 16.83,49.53 17.15,49.85 19.69,49.85 20,49.53 25.4,49.53 v25.72,49.21 | v26.04,55.88 26.35,56.2 43.18,56.2 43.5,55.88 v67.63,55.88 | v72.39,38.1 76.2,34.29 v82.23,34.29
Y2  (via drill 0.61)
  Top 0.254: v12.38,52.39 12.38,50.8 IC2.21 | v46.67,51.75 52.39,46.04 52.39,40.32 v55.56,37.15 | v82.23,31.75 84.14,29.84 U$1.9
  Bottom 0.254: v12.38,52.39 20.32,52.39 20.96,53.02 42.23,53.02 43.5,51.75 v46.67,51.75 | v55.56,37.15 60.64,32.07 81.92,32.07 v82.23,31.75

### Text on the board
tPlace: tdididit.com | A52-FLASHCART